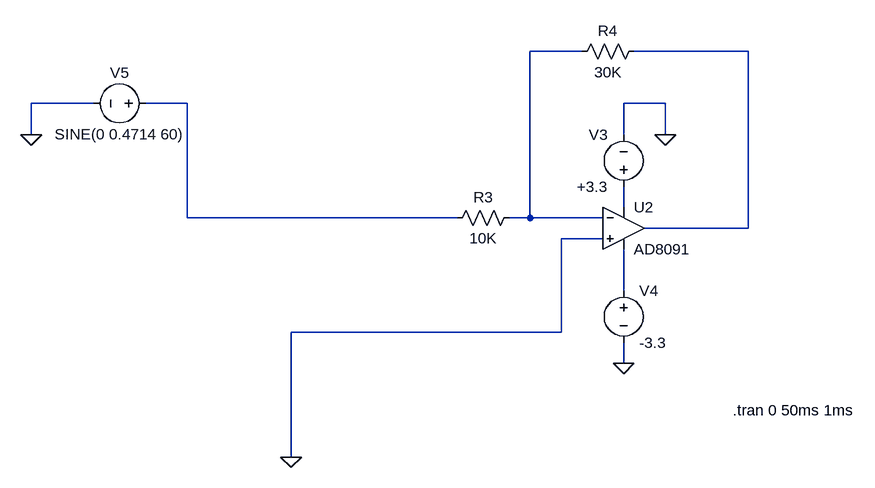
[diagram p0: schematic CTOpAmp.asc]
CTOpAmp.asc, the LTspice schematic file:
Version 4
SHEET 1 880 680
WIRE 272 32 192 32
WIRE 528 32 352 32
WIRE -480 112 -576 112
WIRE -336 112 -400 112
WIRE 400 112 336 112
WIRE -576 160 -576 112
WIRE 336 160 336 112
WIRE 400 160 400 112
WIRE 336 272 336 240
WIRE -336 288 -336 112
WIRE 80 288 -336 288
WIRE 192 288 192 32
WIRE 192 288 160 288
WIRE 304 288 192 288
WIRE 528 304 528 32
WIRE 528 304 368 304
WIRE 304 320 240 320
WIRE 336 400 336 336
WIRE 240 464 240 320
WIRE 240 464 -176 464
WIRE 336 512 336 480
WIRE -176 656 -176 464
FLAG 400 160 0
FLAG 336 512 0
FLAG -176 656 0
FLAG -576 160 0
SYMBOL res 368 16 R90
WINDOW 0 0 56 VBottom 2
WINDOW 3 32 56 VTop 2
SYMATTR InstName R4
SYMATTR Value 30K
SYMBOL res 176 272 R90
WINDOW 0 0 56 VBottom 2
WINDOW 3 32 56 VTop 2
SYMATTR InstName R3
SYMATTR Value 10K
SYMBOL voltage 336 256 R180
WINDOW 0 24 96 Left 2
WINDOW 3 24 16 Left 2
SYMATTR InstName V3
SYMATTR Value +3.3
SYMBOL voltage 336 384 R0
SYMATTR InstName V4
SYMATTR Value -3.3
SYMBOL AD8091 336 240 R0
SYMATTR InstName U2
SYMBOL Voltage -384 112 R90
WINDOW 0 -32 56 VBottom 2
WINDOW 3 32 56 VTop 2
SYMATTR InstName V5
SYMATTR Value SINE(0 0.4714 60)
TEXT 504 584 Left 2 !.tran 0 50ms 1ms

The netlist it stands for:
* CTOpAmp.asc
R4 N002 N001 30K
R3 N001 N003 10K
V3 N004 0 +3.3
V4 N005 0 -3.3
* U2: AD8091 (symbol AD8091 not available, pins judged from their places): In+=0 In-=N001 V+=N004 V-=N005 OUT=N002
V5 N003 0 SINE(0 0.4714 60)
.tran 0 50ms 1ms
.backanno
.end